# Altium schematic sheet CurrentSenseAmp.SchDoc
size A; SheetNumber: 8; SheetTotal: 8
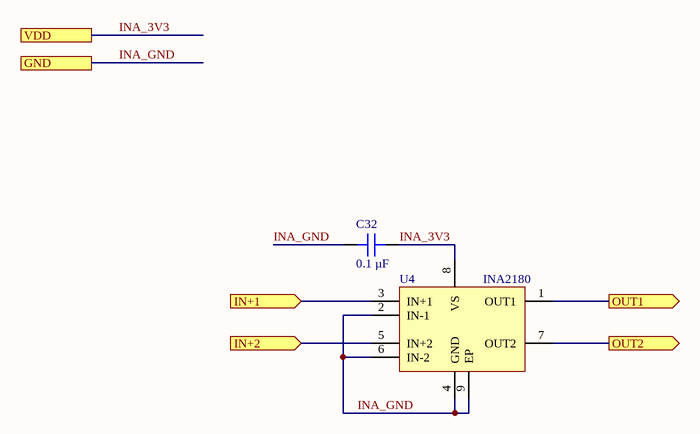
[diagram p0: CurrentSenseAmp.SchDoc]

## Parts
C32  0.1 µF  [CAP 0402_1005]
U4  INA2180  [WSON-8_2x2]

## Ports
GND, IN+1 (in), IN+2 (in), OUT1 (out), OUT2 (out), VDD

## Nets
IN+1: U4.3(IN+1) ; port IN+1
IN+2: U4.5(IN+2) ; port IN+2
INA_3V3: C32.1 U4.8(VS) ; port VDD
INA_GND: C32.2 U4.2(IN-1) U4.4(GND) U4.6(IN-2) U4.9(EP) ; port GND
OUT1: U4.1(OUT1) ; port OUT1
OUT2: U4.7(OUT2) ; port OUT2

## Library data of the parts
C32 = C0402C104K4RACAUTO: CAP CER 0.1UF 16V X7R 0402; manufacturer: KEMET; Tolerance: ±10%; Part Number: C0402C104K4RACAUTO; Value: 0.1 µF; Applications: Automotive, Bypass, Decoupling; Capacitance: 0.1 µF; componentlink1description: Datasheet; componentlink1url: https://api.kemet.com/component-edge/download/specsheet/C0402C104K4RACAUTO.pdf; componentlink2description: DigiKey Link; componentlink2url: https://www.digikey.com/en/products/detail/kemet/C0402C104K4RACAUTO/3314827; Device Package: 0402 (1005 Metric); lastupdated: 8/14/2022 9:05:51 PM; Lifecycle Status: Active; Minimum Order: 1; Mounting Type: Surface Mount, MLCC; Operating Temperature: -55°C ~ 125°C; Package / Case: 0402 (1005 Metric); packaging: TapeAndReel; partid: 3024; Part Status: Active; price: 0.01; Ratings: AEC-Q200; series: SMD Auto X7R; Size / Dimension: 0.039" L x 0.020" W (1.00mm x 0.50mm); Supplier 1: DigiKey; Supplier Part Number 1: 399-6828-1-ND; Temperature Coefficient: X7R; Thickness (Max): 0.022" (0.55mm); Voltage - Rated: 16V
U4 = INA2180: Current sense amplifier 4 channel